# EAGLE design Adder (EAGLE 6.5.0)
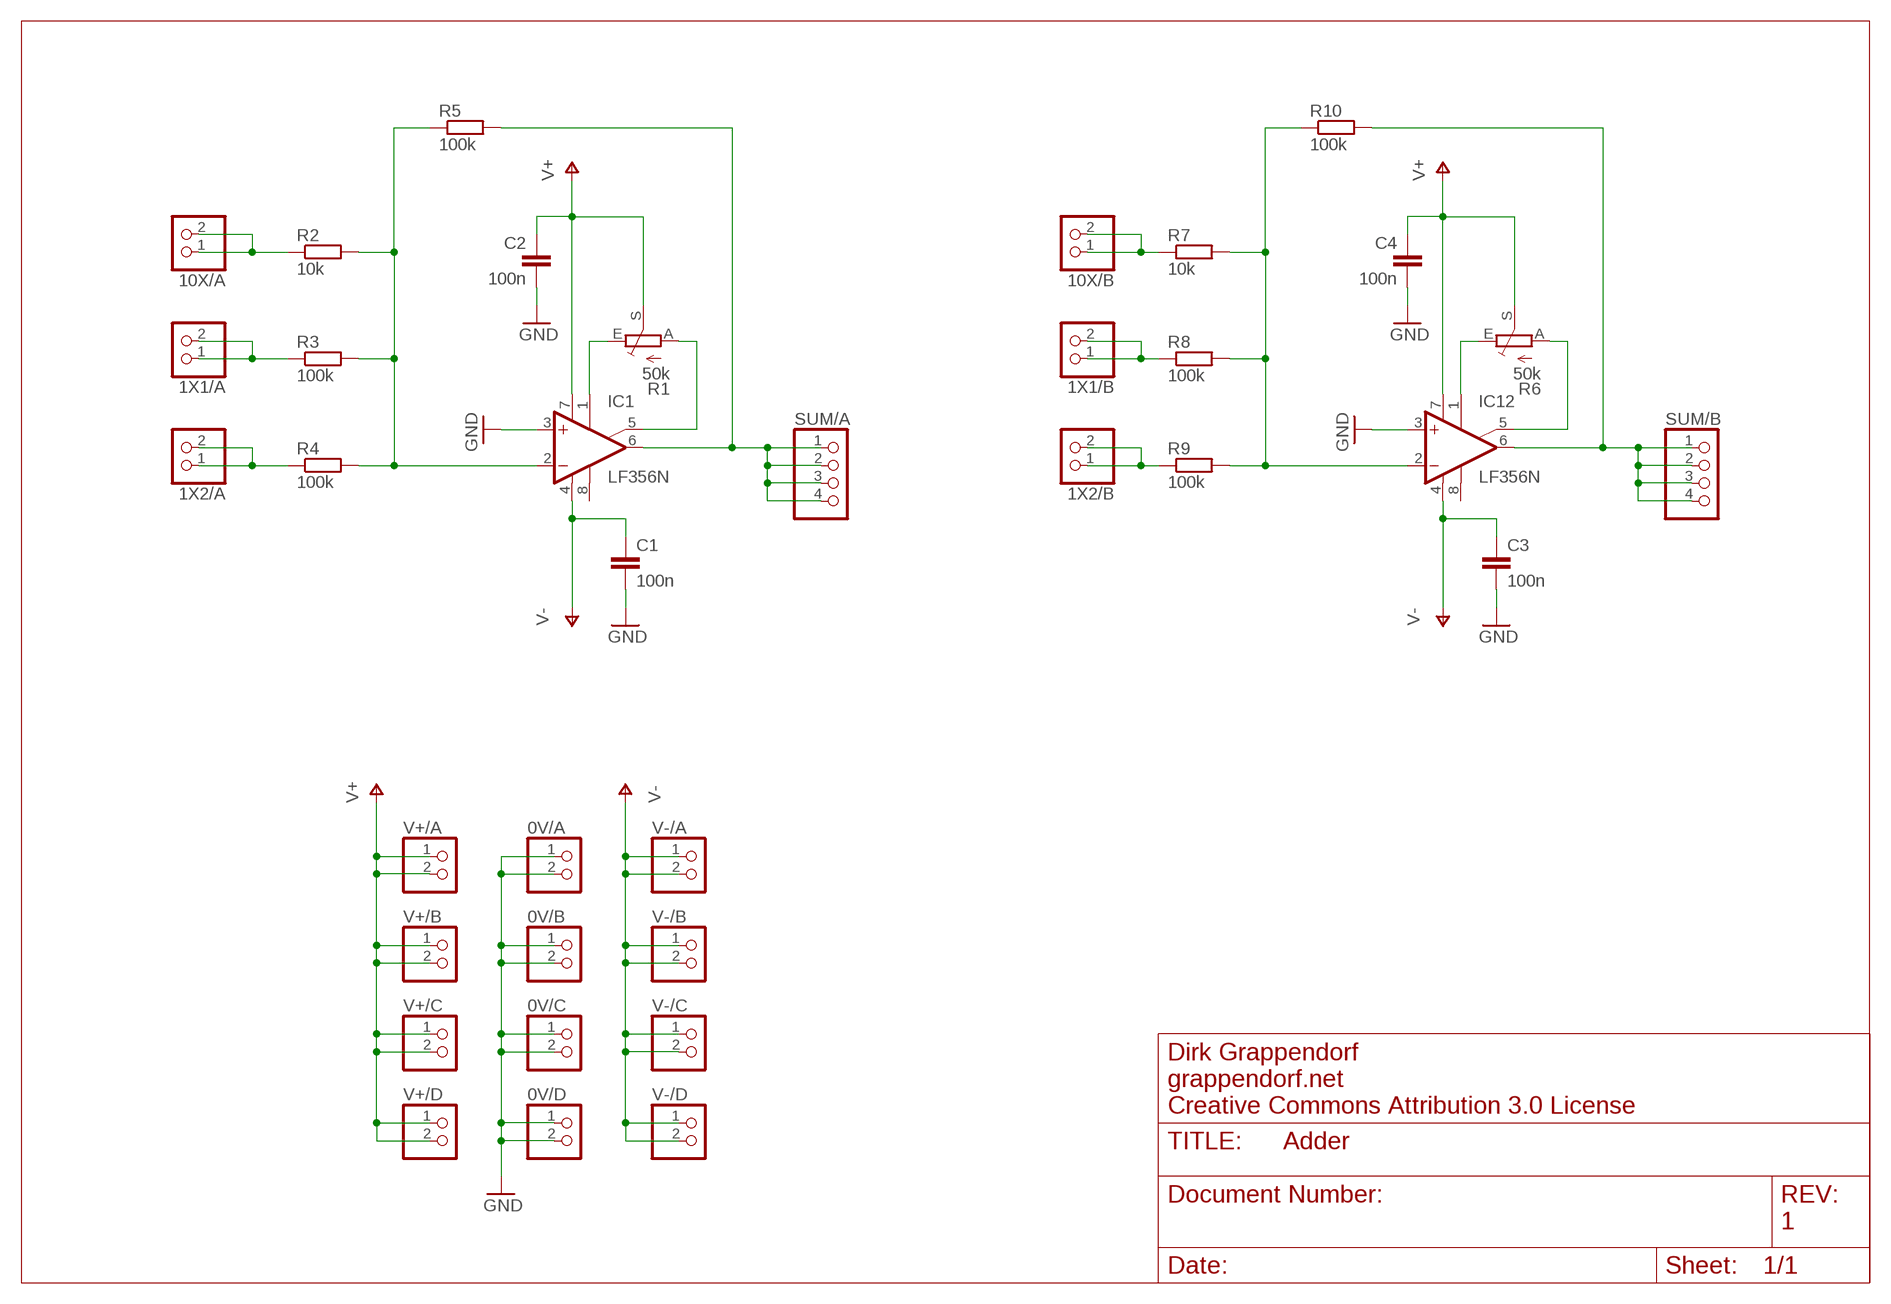
[diagram p0: schematic, sheet 1]

## Parts
0V/A  PINHD-1X2  [1X02]
0V/B  PINHD-1X2  [1X02]
0V/C  PINHD-1X2  [1X02]
0V/D  PINHD-1X2  [1X02]
1X1/A  PINHD-1X2  [1X02]
1X1/B  PINHD-1X2  [1X02]
1X2/A  PINHD-1X2  [1X02]
1X2/B  PINHD-1X2  [1X02]
10X/A  PINHD-1X2  [1X02]
10X/B  PINHD-1X2  [1X02]
C1  100n  C-EU025-025X050  [C025-025X050]
C2  100n  C-EU025-025X050  [C025-025X050]
C3  100n  C-EU025-025X050  [C025-025X050]
C4  100n  C-EU025-025X050  [C025-025X050]
IC1  LF356N  [DIL08]
IC12  LF356N  [DIL08]
R1  50k  TRIM_EU-LI15  [LI15]
R2  10k  R-EU_0207/7  [0207/7]
R3  100k  R-EU_0207/7  [0207/7]
R4  100k  R-EU_0207/7  [0207/7]
R5  100k  R-EU_0207/7  [0207/7]
R6  50k  TRIM_EU-LI15  [LI15]
R7  10k  R-EU_0207/7  [0207/7]
R8  100k  R-EU_0207/7  [0207/7]
R9  100k  R-EU_0207/7  [0207/7]
R10  100k  R-EU_0207/7  [0207/7]
SUM/A  PINHD-1X4  [1X04]
SUM/B  PINHD-1X4  [1X04]
V+/A  PINHD-1X2  [1X02]
V+/B  PINHD-1X2  [1X02]
V+/C  PINHD-1X2  [1X02]
V+/D  PINHD-1X2  [1X02]
V-/A  PINHD-1X2  [1X02]
V-/B  PINHD-1X2  [1X02]
V-/C  PINHD-1X2  [1X02]
V-/D  PINHD-1X2  [1X02]

## Nets
GND: 0V/A.1 0V/A.2 0V/B.1 0V/B.2 0V/C.1 0V/C.2 0V/D.1 0V/D.2 C1.2 C2.2 C3.2 C4.2 IC1.3(+IN) IC12.3(+IN)
N$1: IC1.1(ON1) R1.E
N$2: IC1.5(ON2) R1.A
N$3: IC1.6(OUT) R5.2 SUM/A.1 SUM/A.2 SUM/A.3 SUM/A.4
N$4: IC1.2(-IN) R2.2 R3.2 R4.2 R5.1
N$5: 1X2/A.1 1X2/A.2 R4.1
N$6: 1X1/A.1 1X1/A.2 R3.1
N$7: 10X/A.1 10X/A.2 R2.1
N$8: IC12.1(ON1) R6.E
N$9: IC12.5(ON2) R6.A
N$10: IC12.6(OUT) R10.2 SUM/B.1 SUM/B.2 SUM/B.3 SUM/B.4
N$11: IC12.2(-IN) R7.2 R8.2 R9.2 R10.1
N$12: 1X1/B.1 1X1/B.2 R8.1
N$13: 1X2/B.1 1X2/B.2 R9.1
N$14: 10X/B.1 10X/B.2 R7.1
V+: C2.1 C4.1 IC1.7(V+) IC12.7(V+) R1.S R6.S V+/A.1 V+/A.2 V+/B.1 V+/B.2 V+/C.1 V+/C.2 V+/D.1 V+/D.2
V-: C1.1 C3.1 IC1.4(V-) IC12.4(V-) V-/A.1 V-/A.2 V-/B.1 V-/B.2 V-/C.1 V-/C.2 V-/D.1 V-/D.2
Unconnected: IC1.8(OPT) IC12.8(OPT)

## Notes on the sheet
- Dirk Grappendorf
- grappendorf.net
- Creative Commons Attribution 3.0 License
- 1

## Library data of the parts
0V/A 0V/B 0V/C 0V/D 1X1/A 1X1/B 1X2/A 1X2/B 10X/A 10X/B V+/A V+/B V+/C V+/D V-/A V-/B V-/C V-/D = pinhead:PINHD-1X2: PIN HEADER
C1-C4 = rcl:C-EU: CAPACITOR, European symbol
IC1 IC12 = linear:LF356: OP AMP
R1 R6 = pot:TRIM_EU-: POTENTIOMETER
R2-R5 R7-R10 = rcl:R-EU_: RESISTOR, European symbol
SUM/A SUM/B = pinhead:PINHD-1X4: PIN HEADER

## Board
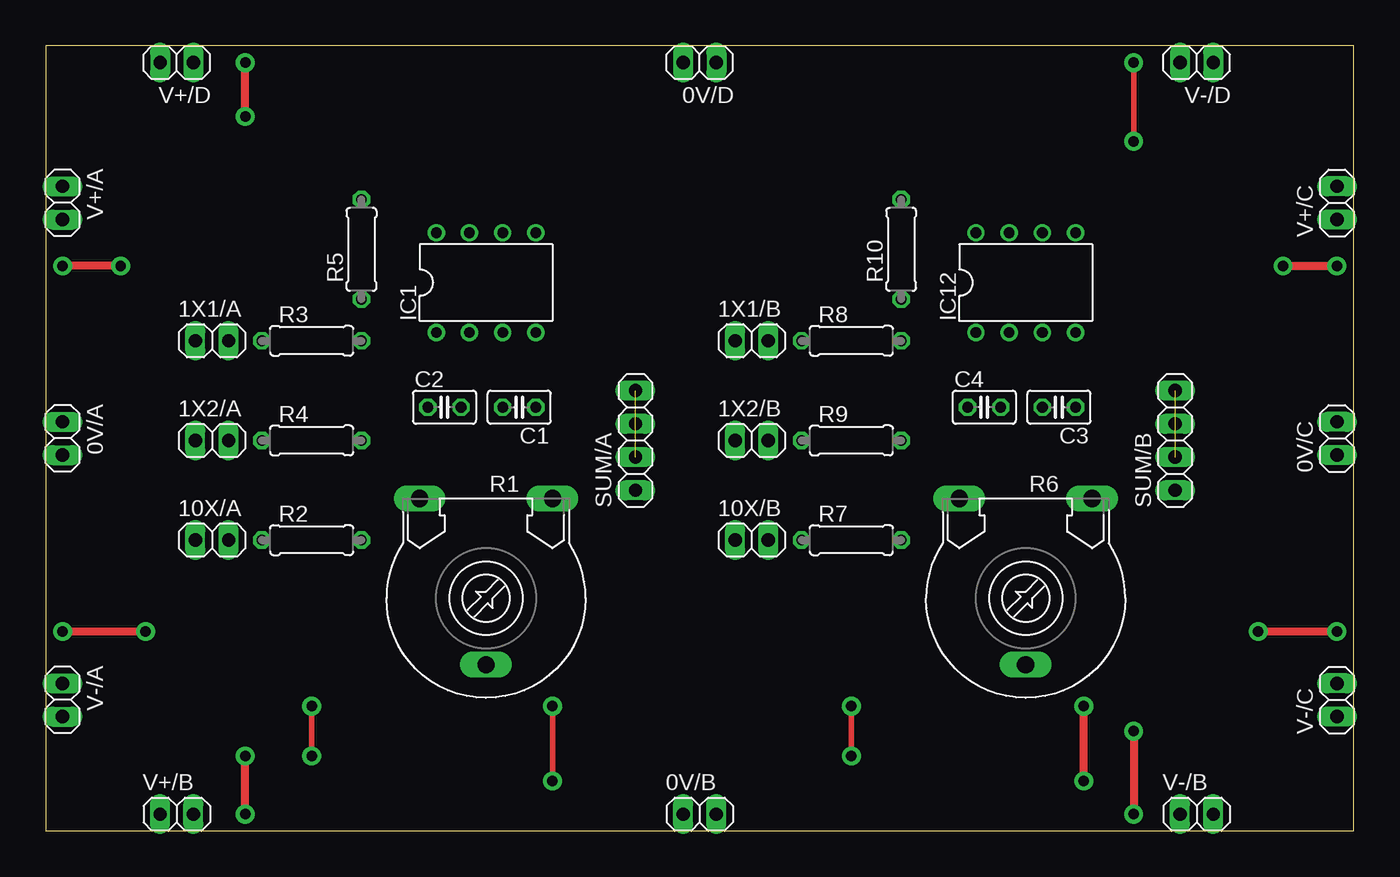
[diagram p1: board, top side]
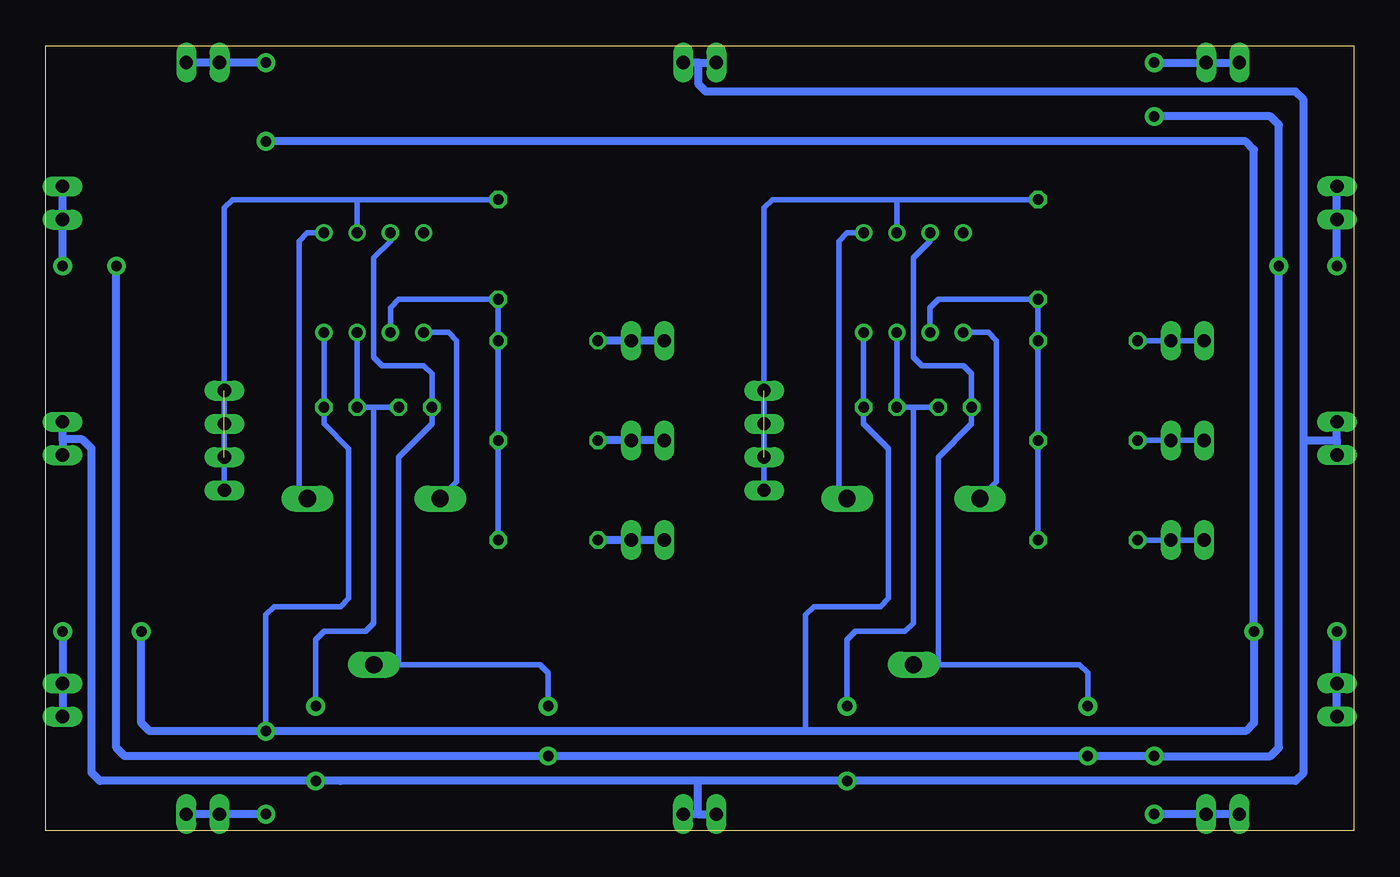
[diagram p2: board, bottom side, seen from below]

Size 100 x 60 mm. Coordinates in mm from the lower left corner, seen from the top.
Outline: 0,0 100,0 100,60 0,60 0,0
Copper layers (1*16): Top 0.035mm / dielectric 1.5mm / Bottom 0.035mm
Design rules "default *": minimum track width 10mil, minimum drill 24mil, track to track 8mil, track to pad 8mil, pad to pad 8mil, via to via 8mil, smd to smd 8mil, copper to edge 40mil, drill to drill 8mil, minimum pad ring 10mil, minimum via ring 8mil, stop-mask expansion 4mil, vias tented up to drill 0mil, thermal gap 10mil

### Footprints (pad centres in the part's own frame; a part is rotated, then mirrored left to right if it is on the bottom)
1X02 = drill 1.016 long: 1 -1.27,0; 2 1.27,0
C025-025X050 = drill 0.813 octagon: 1 -1.27,0; 2 1.27,0
DIL08 = drill 0.813 pad 1.27: 1 -3.81,-3.81; 2 -1.27,-3.81; 3 1.27,-3.81; 4 3.81,-3.81; 5 3.81,3.81; 6 1.27,3.81; 7 -1.27,3.81; 8 -3.81,3.81
LI15 = drill 1.321 long: A -5.08,-7.62; E 5.08,-7.62; S 0,5.08
0207/7 = drill 0.813 octagon: 1 -3.81,0; 2 3.81,0
1X04 = drill 1.016 long: 1 -3.81,0; 2 -1.27,0; 3 1.27,0; 4 3.81,0

### Placement (x,y rotation side)
0V/A  1.27,30 270 top
0V/B  50,1.27 0 top
0V/C  98.73,30 90 top
0V/D  50,58.73 180 top
1X1/A  12.7,37.47 0 top
1X1/B  53.98,37.47 0 top
1X2/A  12.7,29.84 0 top
1X2/B  53.98,29.84 0 top
10X/A  12.7,22.23 0 top
10X/B  53.98,22.23 0 top
C1  36.2,32.38 180 top
C2  30.48,32.38 0 top
C3  77.47,32.38 180 top
C4  71.75,32.38 0 top
IC1  33.66,41.91 0 top
IC12  74.93,41.91 0 top
R1  33.66,17.78 180 top
R2  20.32,22.23 0 top
R3  20.32,37.47 0 top
R4  20.32,29.84 0 top
R5  24.13,44.45 90 top
R6  74.93,17.78 180 top
R7  61.59,22.23 0 top
R8  61.59,37.47 0 top
R9  61.59,29.84 0 top
R10  65.41,44.45 90 top
SUM/A  45.09,29.84 90 top
SUM/B  86.36,29.84 90 top
V+/A  1.27,48 270 top
V+/B  10,1.27 0 top
V+/C  98.73,48 90 top
V+/D  10,58.73 180 top
V-/A  1.27,10 270 top
V-/B  88,1.27 0 top
V-/C  98.73,10 90 top
V-/D  88,58.73 180 top

### Tracks (layer width: path | path; a pad name or v marks a point on that pad's centre or on a via)
GND  (via drill 0.8)
  Top 0.406: v38.73,3.81 v38.73,9.53
  Top 0.61: v79.38,3.81 v79.38,9.53
  Bottom 0.406: IC1.3 C1.2 33.66,32.38 | v38.73,9.53 38.73,14.61 38.1,15.24 34.29,15.24 33.66,15.88 33.66,32.38 | 33.66,32.38 C2.2 | IC12.3 C3.2 74.93,32.38 | v79.38,9.53 79.38,14.61 78.74,15.24 75.56,15.24 74.93,15.88 74.93,32.38 | 74.93,32.38 C4.2
  Bottom 0.61: 1.27,29.84 0V/A.2 | 1.27,29.84 0V/A.1 | 50.08,58.73 0V/D.2 | 50.08,58.73 0V/D.1 | 98.73,29.93 0V/C.1 98.48,28.48 | 98.73,29.93 0V/C.2 | 50.16,1.27 0V/B.1 | 50.16,1.27 0V/B.2 | 3.81,29.84 3.81,5.08 3.81,4.45 4.45,3.81 v38.73,3.81 50.16,3.81 | 3.81,29.84 3.81,55.88 4.45,56.52 49.53,56.52 50.08,57.06 50.08,58.73 | 50.16,3.81 77.47,3.81 | 77.47,3.81 v79.38,3.81 | v79.38,3.81 95.89,3.81 96.52,4.45 96.52,29.21 97.24,29.93 98.73,29.93 | 3.81,29.84 1.27,29.84 | 50.16,3.81 50.16,1.27 | 77.47,3.81 v79.38,3.81
N$1
  Bottom 0.406: IC1.1 27.94,38.1 27.3,37.47 27.3,26.67 R1.E
N$2
  Bottom 0.406: IC1.5 38.73,45.72 39.37,45.09 39.37,26.04 R1.A
N$3  (2 unrouted)
  Bottom 0.406: SUM/A.1 SUM/A.2 45.09,47.62 44.45,48.26 34.92,48.26 | R5.2 34.92,48.26 | 34.92,48.26 IC1.6
N$4
  Bottom 0.406: R2.2 R4.2 R3.2 R5.1 31.75,40.64 32.38,40.01 IC1.2
N$5
  Bottom 0.406: 1X2/A.1 1X2/A.2 R4.1
N$6
  Bottom 0.406: 1X1/A.1 1X1/A.2 R3.1
N$7
  Bottom 0.406: 10X/A.1 10X/A.2 R2.1
N$8
  Bottom 0.406: IC12.1 69.22,38.1 68.58,37.47 68.58,26.67 R6.E
N$9
  Bottom 0.406: IC12.5 80.01,45.72 80.64,45.09 80.64,26.04 R6.A
N$10  (2 unrouted)
  Bottom 0.406: SUM/B.1 SUM/B.2 86.36,47.62 85.72,48.26 76.2,48.26 | R10.2 76.2,48.26 | 76.2,48.26 IC12.6
N$11
  Bottom 0.406: R7.2 R9.2 R8.2 R10.1 73.03,40.64 73.66,40.01 IC12.2
N$12
  Bottom 0.61: 1X1/B.1 1X1/B.2 R8.1
N$13
  Bottom 0.61: 1X2/B.1 1X2/B.2 R9.1
N$14
  Bottom 0.61: 10X/B.1 10X/B.2 R7.1
V+  (via drill 0.8)
  Top 0.406: v20.32,5.71 v20.32,9.53 | v61.59,5.71 v61.59,9.53
  Top 0.61: v5.71,43.18 v1.27,43.18 | v15.24,1.27 v15.24,5.71 | v15.24,54.61 v15.24,58.73 | v94.61,43.18 v98.73,43.18
  Bottom 0.406: IC1.7 32.38,45.09 33.66,43.81 33.66,36.2 33.02,35.56 29.84,35.56 29.21,34.92 C2.1 29.21,31.11 31.75,28.57 31.75,12.7 | v20.32,9.53 20.32,12.06 20.95,12.7 31.75,12.7 | 31.75,12.7 R1.S | v61.59,9.53 61.59,12.06 62.23,12.7 72.39,12.7 | 72.39,12.7 73.03,12.7 | 73.03,12.7 R6.S | 72.39,12.7 73.03,12.7 | 73.03,12.7 73.03,28.57 70.48,31.11 C4.1 70.48,34.92 71.12,35.56 74.3,35.56 74.93,36.2 74.93,43.81 73.66,45.09 IC12.7
  Bottom 0.61: v1.27,43.18 V+/A.2 V+/A.1 | V+/D.2 V+/D.1 14.91,58.73 v15.24,58.73 | V+/C.2 V+/C.1 98.73,43.32 v98.73,43.18 | V+/B.1 V+/B.2 15.05,1.27 v15.24,1.27 | v5.71,43.18 5.71,6.35 6.35,5.71 v15.24,5.71 v20.32,5.71 v61.59,5.71 93.98,5.71 94.61,6.35 v94.61,43.18 | v5.71,43.18 5.71,43.72 | v15.24,54.61 6.35,54.61 5.71,53.98 v5.71,43.18
V-  (via drill 0.8)
  Top 0.406: v83.19,52.7 v83.19,58.73
  Top 0.61: v1.27,15.24 v7.62,15.24 | v92.71,15.24 v98.73,15.24 | v83.19,7.62 v83.19,1.27
  Bottom 0.406: IC1.4 C1.1 37.47,31.11 35.56,29.21 35.56,17.78 36.2,17.14 41.27,17.14 41.91,16.51 41.91,7.62 | v83.19,7.62 83.19,16.51 82.55,17.14 77.47,17.14 76.83,17.78 76.83,29.21 78.74,31.11 C3.1 IC12.4
  Bottom 0.61: V-/A.2 V-/A.1 1.27,15.05 v1.27,15.24 | V-/C.1 V-/C.2 98.73,14.91 v98.73,15.24 | V-/B.2 V-/B.1 v83.19,1.27 | V-/D.1 V-/D.2 83.32,58.73 v83.19,58.73 | v92.71,15.24 92.71,8.26 92.08,7.62 v83.19,7.62 41.91,7.62 8.26,7.62 7.62,8.26 v7.62,15.24 7.62,52.07 8.26,52.7 v83.19,52.7